# Altium schematic sheet RFEv2.SchDoc
size A3
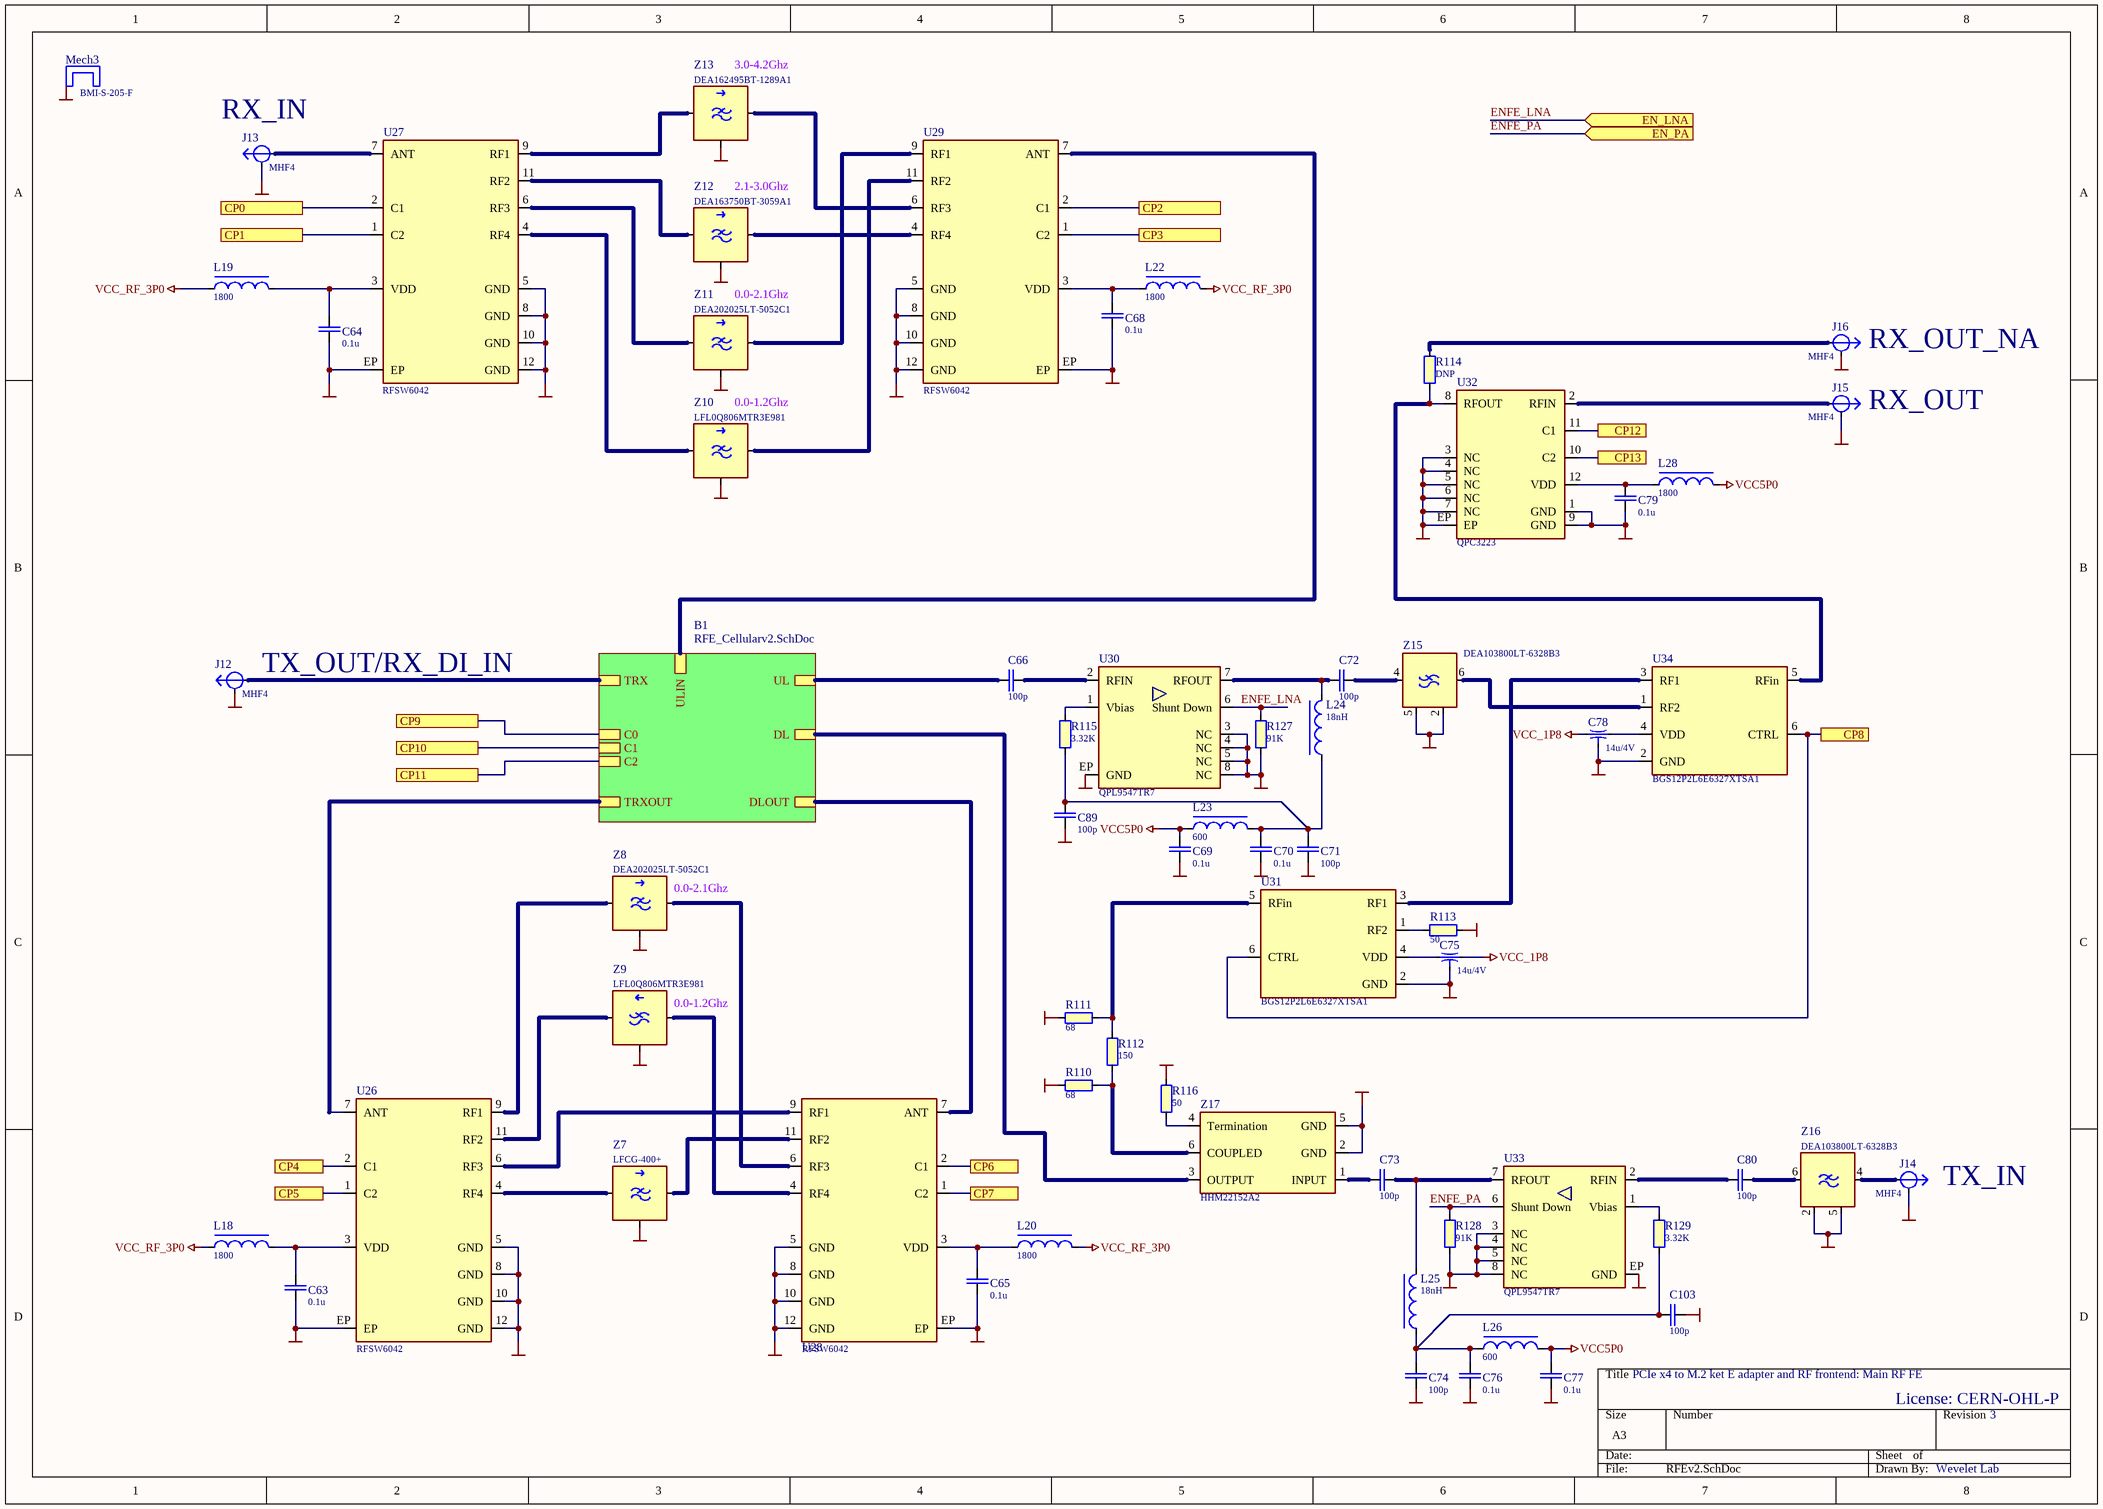
[diagram p0: RFEv2.SchDoc]

## Parts
C63  value 0.1u  [CAPC100X50X55L25N]  (hidden comment: GRM155R71E104KE14D)
C64  value 0.1u  [CAPC100X50X55L25N]  (hidden comment: GRM155R71E104KE14D)
C65  value 0.1u  [CAPC100X50X55L25N]  (hidden comment: GRM155R71E104KE14D)
C66  value 100p  [CAPC100X50X55L25N]  (hidden comment: Cap-0402-NP0-50V-100p-20%)
C68  value 0.1u  [CAPC100X50X55L25N]  (hidden comment: GRM155R71E104KE14D)
C69  value 0.1u  [CAPC100X50X55L25N]  (hidden comment: GRM155R71E104KE14D)
C70  value 0.1u  [CAPC100X50X55L25N]  (hidden comment: GRM155R71E104KE14D)
C71  value 100p  [CAPC100X50X55L25N]  (hidden comment: Cap-0402-NP0-50V-100p-20%)
C72  value 100p  [CAPC100X50X55L25N]  (hidden comment: Cap-0402-NP0-50V-100p-20%)
C73  value 100p  [CAPC100X50X55L25N]  (hidden comment: Cap-0402-NP0-50V-100p-20%)
C74  value 100p  [CAPC100X50X55L25N]  (hidden comment: Cap-0402-NP0-50V-100p-20%)
C75  value 14u/4V  [CAPCEMI100X50X50L20N]  (hidden comment: NFM15PC146R0G3D)
C76  value 0.1u  [CAPC100X50X55L25N]  (hidden comment: GRM155R71E104KE14D)
C77  value 0.1u  [CAPC100X50X55L25N]  (hidden comment: GRM155R71E104KE14D)
C78  value 14u/4V  [CAPCEMI100X50X50L20N]  (hidden comment: NFM15PC146R0G3D)
C79  value 0.1u  [CAPC100X50X55L25N]  (hidden comment: GRM155R71E104KE14D)
C80  value 100p  [CAPC100X50X55L25N]  (hidden comment: Cap-0402-NP0-50V-100p-20%)
C89  value 100p  [CAPC100X50X55L25N]  (hidden comment: Cap-0402-NP0-50V-100p-20%)
C103  value 100p  [CAPC100X50X55L25N]  (hidden comment: Cap-0402-NP0-50V-100p-20%)
J12  value MHF4  [LINX_CONMHF4-SMD-G-T]  (hidden comment: CONMHF4-SMD-G-T)
J13  value MHF4  [LINX_CONMHF4-SMD-G-T]  (hidden comment: CONMHF4-SMD-G-T)
J14  value MHF4  [LINX_CONMHF4-SMD-G-T]  (hidden comment: CONMHF4-SMD-G-T)
J15  value MHF4  [LINX_CONMHF4-SMD-G-T]  (hidden comment: CONMHF4-SMD-G-T)
J16  value MHF4  [LINX_CONMHF4-SMD-G-T]  (hidden comment: CONMHF4-SMD-G-T)
L18  value 1800  [INDC100X60X60L30N]  (hidden comment: BLM15HD182SN1D)
L19  value 1800  [INDC100X60X60L30N]  (hidden comment: BLM15HD182SN1D)
L20  value 1800  [INDC100X60X60L30N]  (hidden comment: BLM15HD182SN1D)
L22  value 1800  [INDC100X60X60L30N]  (hidden comment: BLM15HD182SN1D)
L23  value 600  [INDC100X60X60L30N]  (hidden comment: BLM15HG601SN1D)
L24  value 18nH  [CAPC100X50X55L25N]  (hidden comment: MLK1005S18NJT000)
L25  value 18nH  [CAPC100X50X55L25N]  (hidden comment: MLK1005S18NJT000)
L26  value 600  [INDC100X60X60L30N]  (hidden comment: BLM15HG601SN1D)
L28  value 1800  [INDC100X60X60L30N]  (hidden comment: BLM15HD182SN1D)
Mech3  BMI-S-205-F  [LAIRD_BMI-S-205]
R110  value 68  [RESC100X50X40L20N]  (hidden comment: RC0402FR-0768RL)
R111  value 68  [RESC100X50X40L20N]  (hidden comment: RC0402FR-0768RL)
R112  value 150  [RESC100X50X40L20N]  (hidden comment: RC0402FR-07150RL)
R113  value 50  [RESC100X50X40L20N]  (hidden comment: RC0402FR-0750RL)
R114  value DNP  [RESC100X50X40L20N]  (hidden comment: Res-0402-DNP)  (no BOM)
R115  value 3.32K  [RESC100X50X40L20N]  (hidden comment: RC0402FR-073K32L)
R116  value 50  [RESC100X50X40L20N]  (hidden comment: RC0402FR-0750RL)
R127  value 91K  [RESC100X50X40L20N]  (hidden comment: RC0402FR-0791KL)
R128  value 91K  [RESC100X50X40L20N]  (hidden comment: RC0402FR-0791KL)
R129  value 3.32K  [RESC100X50X40L20N]  (hidden comment: RC0402FR-073K32L)
U26  RFSW6042  [QFN13P40_180X180X60L25X18T80N]
U27  RFSW6042  [QFN13P40_180X180X60L25X18T80N]
U28  RFSW6042  [QFN13P40_180X180X60L25X18T80N]
U29  RFSW6042  [QFN13P40_180X180X60L25X18T80N]
U30  QPL9547TR7  [SON9P50_200X200X100L30X25T160X80N]
U31  BGS12P2L6E6327XTSA1  [PSON6P40_110X70X32L20X20N]
U32  QPC3223  [QFN13P50_300X300X90L50X23T120N]
U33  QPL9547TR7  [SON9P50_200X200X100L30X25T160X80N]
U34  BGS12P2L6E6327XTSA1  [PSON6P40_110X70X32L20X20N]
Z7  LFCG-400+  [Mini-Circuits_ GE0805C-2]
Z8  DEA202025LT-5052C1  [TDK_DEA202025LT-5052C1]
Z9  LFL0Q806MTR3E981  [MURATA_LFL0Q806MTR3E981]
Z10  LFL0Q806MTR3E981  [MURATA_LFL0Q806MTR3E981]
Z11  DEA202025LT-5052C1  [TDK_DEA202025LT-5052C1]
Z12  DEA163750BT-3059A1  [TDK_DEA163750BT-3059A1]
Z13  DEA162495BT-1289A1  [TDK_DEA162495BT-1289A1]
Z15  DEA103800LT-6328B3  [TDK_DEA10-L]
Z16  DEA103800LT-6328B3  [TDK_DEA10-L]
Z17  HHM22152A2  [TDK_HHM22152A2]

## Sub-sheets
B1 = RFE_Cellularv2.SchDoc: TRX, UL, DL, C0, C1, C2, ULIN, DLOUT, TRXOUT

## Ports
CP0, CP1, CP2, CP3, CP4, CP5, CP6, CP7, CP8, CP9, CP10, CP11, CP12, CP13, EN_LNA (in), EN_PA (in)

## Nets
GND: C63.2 C64.2 C65.2 C68.2 C69.2 C70.2 C71.1 C74.1 C75.2(GND) C76.2 C77.2 C78.2(GND) C79.2 C89.1 C103.1 J12.SH J13.SH J14.SH J15.SH J16.SH Mech3.SH R110.1 R111.1 R113.2 R116.2 R127.1 R128.1 U26.5(GND) U26.8(GND) U26.10(GND) U26.12(GND) U26.EP U27.5(GND) U27.8(GND) U27.10(GND) U27.12(GND) U27.EP U28.5(GND) U28.8(GND) U28.10(GND) U28.12(GND) U28.EP U29.5(GND) U29.8(GND) U29.10(GND) U29.12(GND) U29.EP U30.3(NC) U30.4(NC) U30.5(NC) U30.8(NC) U30.EP(GND) U31.2(GND) U32.1(GND) U32.3(NC) U32.4(NC) U32.5(NC) U32.6(NC) U32.7(NC) U32.9(GND) U32.EP U33.3(NC) U33.4(NC) U33.5(NC) U33.8(NC) U33.EP(GND) U34.2(GND) Z7.2 Z8.2 Z9.3 Z10.3 Z11.2 Z12.2 Z13.2 Z15.2 Z15.5 Z16.2 Z16.5 Z17.2(GND) Z17.5(GND)
VCC5P0: C69.1 C77.1 L23.2 L26.2 L28.1
VCC_1P8: C75.1 C78.1
VCC_RF_3P0: L18.1 L19.1 L20.2 L22.2
CP0: U27.2(C1) ; port CP0
CP1: U27.1(C2) ; port CP1
CP2: U29.2(C1) ; port CP2
CP3: U29.1(C2) ; port CP3
CP4: U26.2(C1) ; port CP4
CP5: U26.1(C2) ; port CP5
CP6: U28.2(C1) ; port CP6
CP7: U28.1(C2) ; port CP7
CP8: U31.6(CTRL) U34.6(CTRL) ; port CP8
CP9: port CP9, sheet B1/C0
CP10: port CP10, sheet B1/C1
CP11: port CP11, sheet B1/C2
CP12: U32.11(C1) ; port CP12
CP13: U32.10(C2) ; port CP13
ENFE_LNA: R127.2 U30.6(Shunt_Down) ; port EN_LNA
ENFE_PA: R128.2 U33.6(Shunt_Down) ; port EN_PA
NetC63_1: C63.1 L18.2 U26.3(VDD)
NetC64_1: C64.1 L19.2 U27.3(VDD)
NetC65_1: C65.1 L20.1 U28.3(VDD)
NetC66_1: C66.1 ; sheet B1/UL
NetC66_2: C66.2 U30.2(RFIN)
NetC68_1: C68.1 L22.1 U29.3(VDD)
NetC70_1: C70.1 C71.2 C89.2 L23.1 L24.1 R115.1
NetC72_1: C72.1 L24.2 U30.7(RFOUT)
NetC72_2: C72.2 Z15.4
NetC73_1: C73.1 Z17.1(INPUT)
NetC73_2: C73.2 L25.2 U33.7(RFOUT)
NetC74_2: C74.2 C76.1 C103.2 L25.1 L26.1 R129.1
NetC75_3: C75.3 U31.4(VDD)
NetC78_3: C78.3 U34.4(VDD)
NetC79_1: C79.1 L28.2 U32.12(VDD)
NetC80_1: C80.1 U33.2(RFIN)
NetC80_2: C80.2 Z16.6
NetJ12_1: J12.1 ; sheet B1/TRX
NetJ13_1: J13.1 U27.7(ANT)
NetJ14_1: J14.1 Z16.4
NetJ15_1: J15.1 U32.2(RFIN)
NetJ16_1: J16.1 R114.1
NetR110_2: R110.2 R112.2 Z17.6(COUPLED)
NetR111_2: R111.2 R112.1 U31.5(RFin)
NetR113_1: R113.1 U31.1(RF2)
NetR114_2: R114.2 U32.8(RFOUT) U34.5(RFin)
NetR115_2: R115.2 U30.1(Vbias)
NetR116_1: R116.1 Z17.4(Termination)
NetR129_2: R129.2 U33.1(Vbias)
NetU26_4: U26.4(RF4) Z7.1
NetU26_6: U26.6(RF3) U28.9(RF1)
NetU26_7: U26.7(ANT) ; sheet B1/TRXOUT
NetU26_9: U26.9(RF1) Z8.1
NetU26_11: U26.11(RF2) Z9.1
NetU27_4: U27.4(RF4) Z10.2
NetU27_6: U27.6(RF3) Z11.1
NetU27_9: U27.9(RF1) Z13.1
NetU27_11: U27.11(RF2) Z12.1
NetU28_4: U28.4(RF4) Z9.2
NetU28_6: U28.6(RF3) Z8.3
NetU28_7: U28.7(ANT) ; sheet B1/DLOUT
NetU28_11: U28.11(RF2) Z7.3
NetU29_4: U29.4(RF4) Z12.3
NetU29_6: U29.6(RF3) Z13.3
NetU29_7: U29.7(ANT) ; sheet B1/ULIN
NetU29_9: U29.9(RF1) Z11.3
NetU29_11: U29.11(RF2) Z10.1
NetU31_3: U31.3(RF1) U34.3(RF1)
NetU34_1: U34.1(RF2) Z15.6
NetZ17_3: Z17.3(OUTPUT) ; sheet B1/DL

## Notes on the sheet
- (near Z13) 3.0-4.2Ghz
- (near J13) RX_IN
- 2.1-3.0Ghz
- 0.0-2.1Ghz
- (near J16) RX_OUT_NA
- 0.0-1.2Ghz
- RX_OUT
- (near J12) TX_OUT/RX_DI_IN
- (near Z8) 0.0-2.1Ghz
- (near Z9) 0.0-1.2Ghz
- (near J14) TX_IN
- PCIe x4 to M.2 ket E adapter and RF frontend: Main RF FE
- License: CERN-OHL-P
- 3
- Wevelet Lab

## Library data of the parts
C63-C65 C68-C70 C76 C77 C79 = GRM155R71E104KE14D: Capacitor, 0.1u, 25V, 10%, X7R, 0402; Manufacturer: Murata Electronics
C66 C71-C74 C80 C89 C103 = Cap-0402-NP0-50V-100p-20%: Capacitor, 100p, 50V, 20%, NP0, 0402; Manufacturer: *
C75 C78 = NFM15PC146R0G3D: Capacitor feedthru, 14u, 4V, 20%, 2A, 0402; Manufacturer: Murata Electronics; Name: NFM15PC146R0G3D
J12-J16 = CONMHF4-SMD-G-T: Conn, IPEX MHF4, Male Pin, 50 Ohm, -65/+165, SMD; Manufacturer: Linx Technologies Inc.; Name: CONMHF4-SMD-G-T
L18-L20 L22 L28 = BLM15HD182SN1D: Ferrite bead, 1800Ohm@100MHz, 0,2A, 2.2Ohm, -55/+125, SMD0402; Manufacturer: Murata Electronics; Name: BLM15HD182SN1D
L23 L26 = BLM15HG601SN1D: Ferrite bead, 600Ohm@100MHz, 0,3A, 700mOhm, -55/+125, SMD0402; Manufacturer: Murata Electronics; Name: BLM15HG601SN1D
L24 L25 = MLK1005S18NJT000: Inductor, 18n, -55/+125, SMD0402; Manufacturer: TDK; Name: MLK1005S18NJT000
Mech3 = BMI-S-205-F: EMI Gaskets, Sheets, Absorbers & Shielding; Manufacturer: Laird Performance Materials; Value: BMI-S-205-F
R110 R111 = Res-0402-68-5%: Resistor, 68, 0.063W, 5%, 0402; Manufacturer: *; Name: RC0402FR-0768RL
R112 = Res-0402-150-5%: Resistor, 150, 0.063W, 5%, 0402; Manufacturer: *; Name: RC0402FR-07150RL
R113 R116 = Res-0402-50-5%: Resistor, 50, 0.063W, 5%, 0402; Manufacturer: *; Name: RC0402FR-0750RL
R114 = Res-0402-DNP: Resistor, DNP, 0.063W, 5%, 0402; Manufacturer: *
R115 R129 = Res-0402-3.32K-1%: Resistor, 3.32K, 0.063W, 1%, 0402; Manufacturer: *; Name: RC0402FR-073K32L
R127 R128 = Res-0402-91K-5%: Resistor, 91K, 0.063W, 5%, 0402; Manufacturer: *; Name: RC0402FR-0791KL
U26-U29 = RFSW6042: IC, Switch, SP4T, 5-6000MHz, -40/+85, / 12-QFN; Manufacturer: Qorvo; Value: RFSW6042
U30 U33 = QPL9547: IC, 0.1 -6 GHz Ultra Low-Noise LNA, SON-8; Manufacturer: QORVO; Value: QPL9547TR7
U31 U34 = BGS12P2L6E6327XTSA1: IC, RF switch, SPDT, 50Ohm -40/+85, TSLP-6-4; Manufacturer: Infineon Technologies; Value: BGS12P2L6E6327XTSA1
U32 = QPC3223: IC, Digital step attenuator, -40/+105, QFN-12; Manufacturer: QORVO; Value: QPC3223
Z7 = LFCG-400+: Filter Low Pass, 50Ohm, 400MHz, 30dB, -55/+125, SMD; Manufacturer: Mini-Circuits; Value: LFCG-400+
Z8 Z11 = DEA202025LT-5052C1: RF FILTER, 1880-2023MHZ  -40/+85, 0805; Manufacturer: TDK Corporation; Value: DEA202025LT-5052C1
Z9 Z10 = LFL0Q806MTR3E981: RF FILTER, 0-1200MHZ  -40/+85, Smd; Manufacturer: Murata Electronics; Value: LFL0Q806MTR3E981
Z12 = DEA163750BT-3059A1: RF FILTER, 3300-4200MHZ  -40/+85, 0603; Manufacturer: TDK Corporation; Value: DEA163750BT-3059A1
Z13 = DEA162495BT-1289A1: RF FILTER, 2300-2690MHZ  -40/+85, 0603; Manufacturer: TDK Corporation; Value: DEA162495BT-1289A1
Z15 Z16 = DEA103800LT-6328B3: Filter Low Pass, 2.25GHz, 4.6dB, -40/+85, SMD; Manufacturer: TDK Corporation; Value: DEA103800LT-6328B3
Z17 = HHM22152A2: Signal Coupler, 450-3800MHz, -40/+105, SMD; Manufacturer: TDK; Value: HHM22152A2